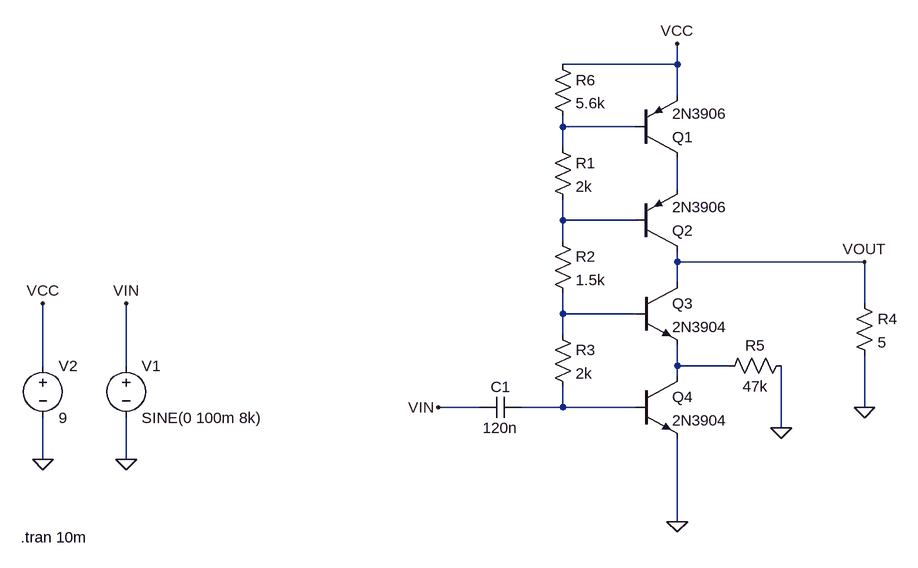
[diagram p0: schematic gain-stage.asc]
gain-stage.asc, the LTspice schematic file:
Version 4
SHEET 1 880 680
WIRE -336 -112 -336 -144
WIRE -336 -112 -512 -112
WIRE -336 -64 -336 -112
WIRE -512 -16 -512 -32
WIRE -400 -16 -512 -16
WIRE -512 16 -512 -16
WIRE -336 80 -336 32
WIRE -512 128 -512 96
WIRE -400 128 -512 128
WIRE -512 160 -512 128
WIRE -336 192 -336 176
WIRE -48 192 -336 192
WIRE -336 224 -336 192
WIRE -48 256 -48 192
WIRE -512 272 -512 240
WIRE -400 272 -512 272
WIRE -512 304 -512 272
WIRE -1312 352 -1312 256
WIRE -1184 352 -1184 256
WIRE -336 352 -336 320
WIRE -256 352 -336 352
WIRE -336 368 -336 352
WIRE -640 416 -704 416
WIRE -512 416 -512 384
WIRE -512 416 -576 416
WIRE -400 416 -512 416
WIRE -48 416 -48 336
WIRE -176 448 -176 352
WIRE -1312 496 -1312 432
WIRE -1184 496 -1184 432
WIRE -336 592 -336 464
FLAG -1312 496 0
FLAG -1184 496 0
FLAG -336 592 0
FLAG -1312 256 VCC
FLAG -1184 256 VIN
FLAG -336 -144 VCC
FLAG -704 416 VIN
FLAG -176 448 0
FLAG -48 416 0
FLAG -48 192 VOUT
SYMBOL pnp -400 32 M180
SYMATTR InstName Q1
SYMATTR Value 2N3906
SYMBOL pnp -400 176 M180
SYMATTR InstName Q2
SYMATTR Value 2N3906
SYMBOL npn -400 224 R0
SYMATTR InstName Q3
SYMATTR Value 2N3904
SYMBOL npn -400 368 R0
SYMATTR InstName Q4
SYMATTR Value 2N3904
SYMBOL voltage -1184 336 R0
WINDOW 123 0 0 Left 0
WINDOW 39 0 0 Left 0
SYMATTR InstName V1
SYMATTR Value SINE(0 100m 8k)
SYMBOL voltage -1312 336 R0
WINDOW 123 0 0 Left 0
WINDOW 39 0 0 Left 0
SYMATTR InstName V2
SYMATTR Value 9
SYMBOL res -528 0 R0
SYMATTR InstName R1
SYMATTR Value 2k
SYMBOL res -528 144 R0
SYMATTR InstName R2
SYMATTR Value 1.5k
SYMBOL res -528 288 R0
SYMATTR InstName R3
SYMATTR Value 2k
SYMBOL cap -576 400 R90
WINDOW 0 0 32 VBottom 2
WINDOW 3 32 32 VTop 2
SYMATTR InstName C1
SYMATTR Value 120n
SYMBOL res -160 336 R90
WINDOW 0 0 56 VBottom 2
WINDOW 3 32 56 VTop 2
SYMATTR InstName R5
SYMATTR Value 47k
SYMBOL res -528 -128 R0
SYMATTR InstName R6
SYMATTR Value 5.6k
SYMBOL res -64 240 R0
SYMATTR InstName R4
SYMATTR Value 5
TEXT -1346 616 Left 2 !.tran 10m

The netlist it stands for:
* gain-stage.asc
Q1 N002 N001 VCC 0 2N3906
Q2 VOUT N003 N002 0 2N3906
Q3 VOUT N004 N005 0 2N3904
Q4 N005 N006 0 0 2N3904
V1 VIN 0 SINE(0 100m 8k)
V2 VCC 0 9
R1 N001 N003 2k
R2 N003 N004 1.5k
R3 N004 N006 2k
C1 N006 VIN 120n
R5 0 N005 47k
R6 VCC N001 5.6k
R4 VOUT 0 5
.model NPN NPN
.model PNP PNP
.lib standard.bjt
.tran 10m
.backanno
.end